# Altium project yfly.PrjPcb
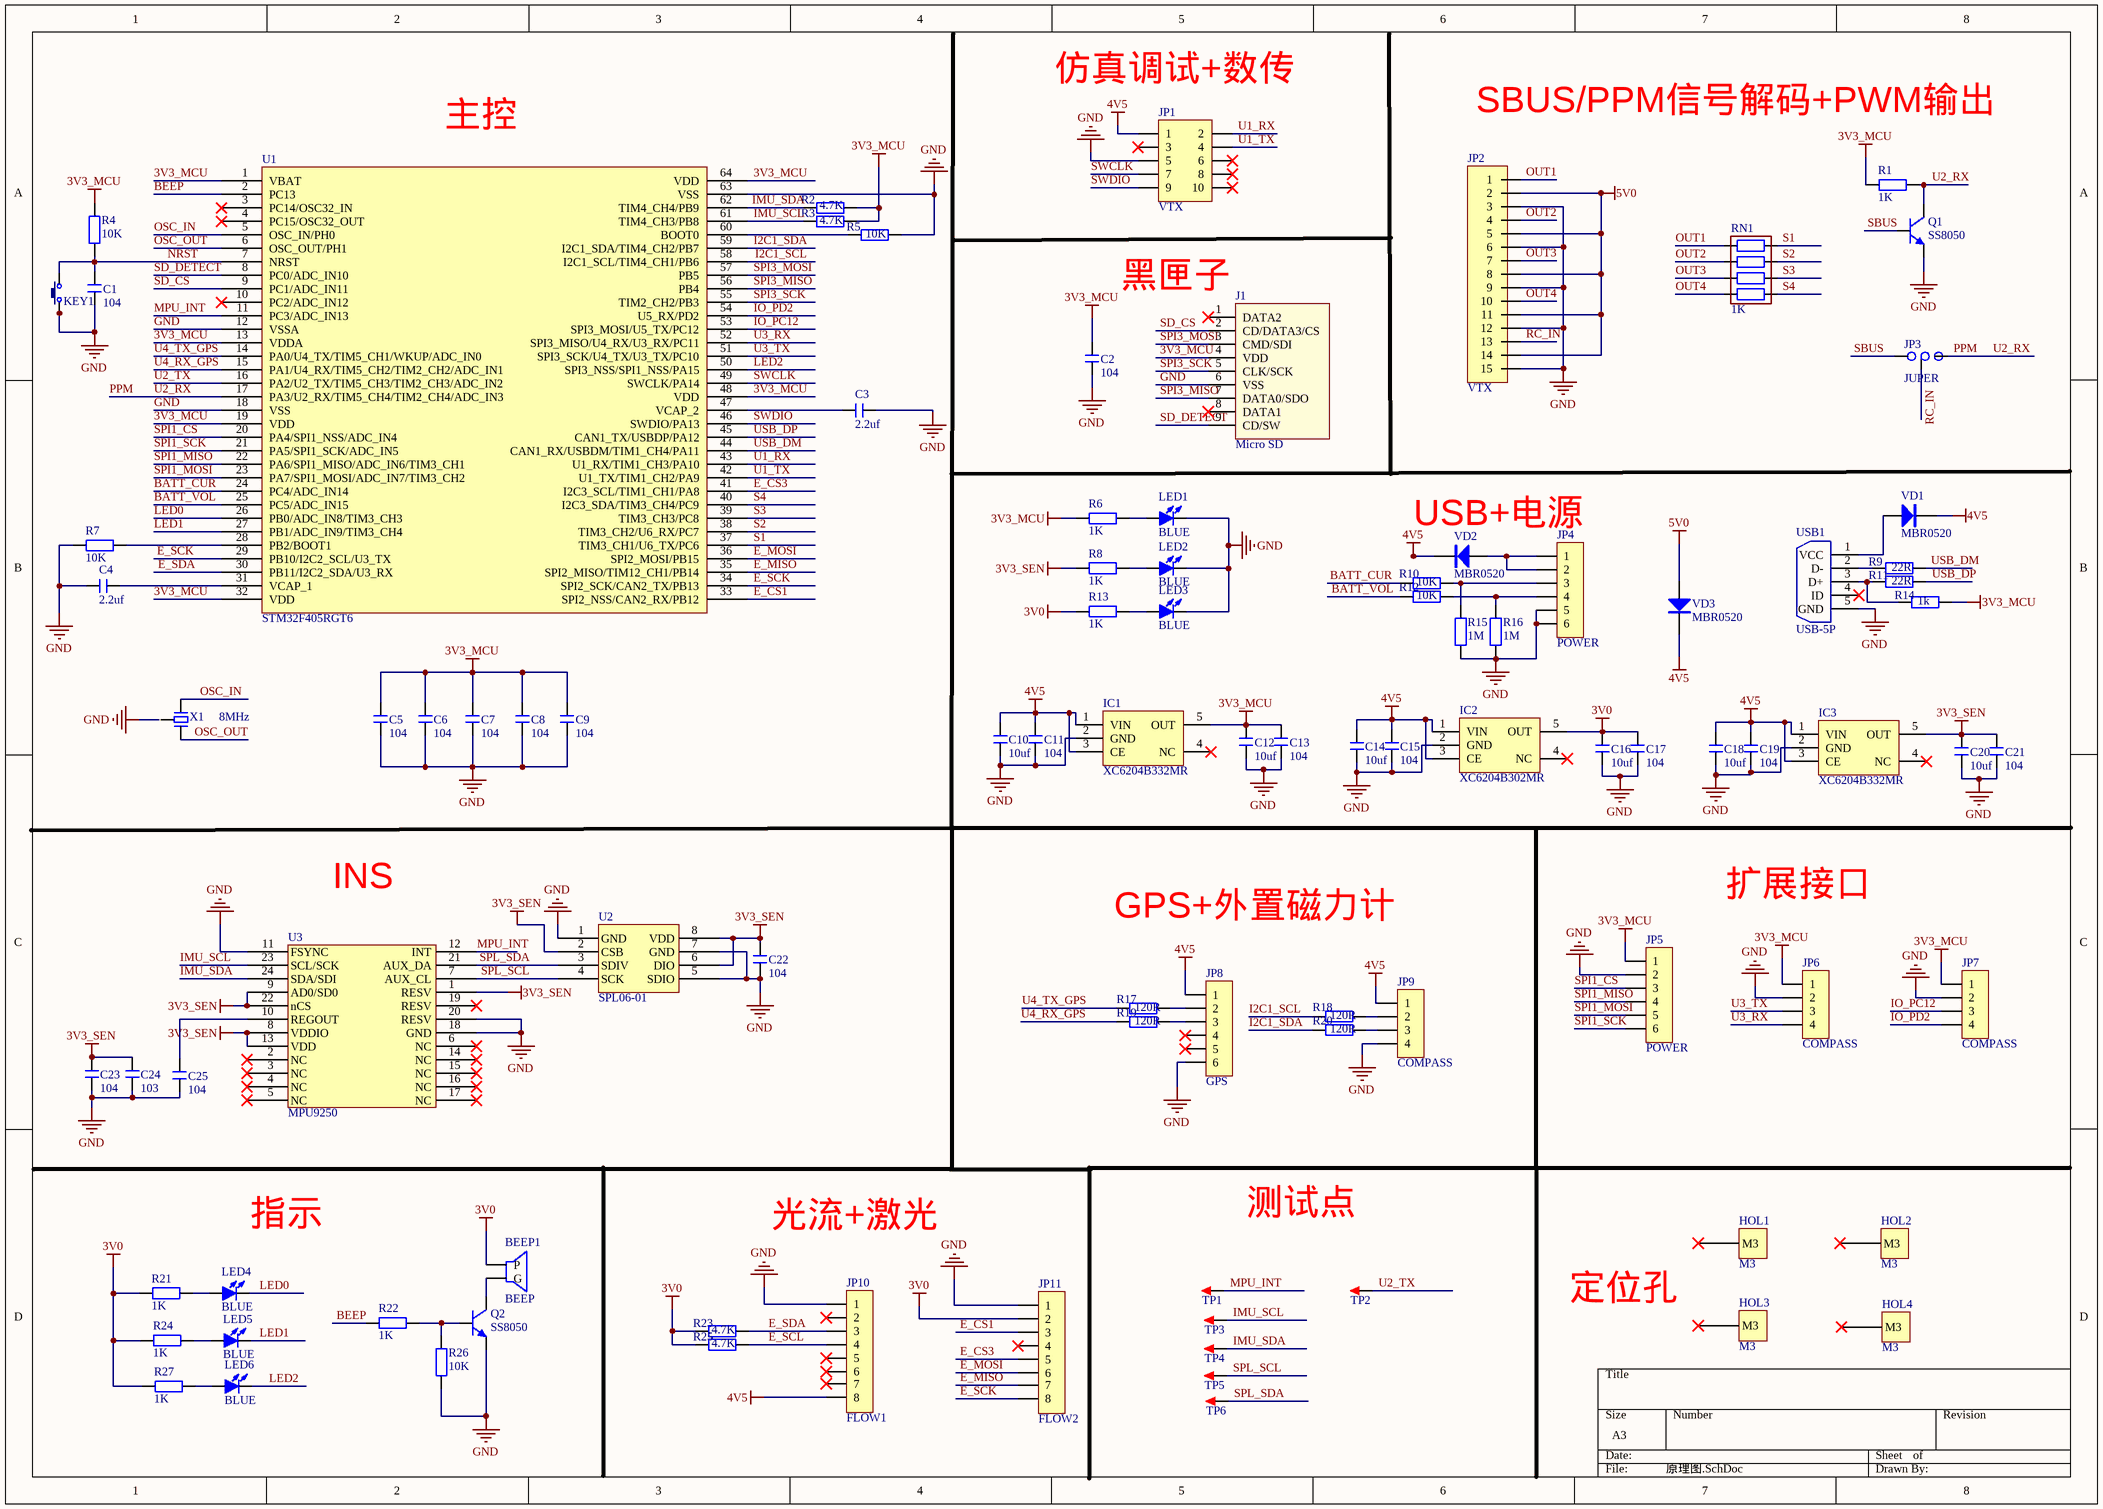
[diagram p0: 原理图.SchDoc]
1 sheet, 96 parts. Net scope: global (net labels, ports and power ports of the same name join across sheets).
Board file: PCB.PcbDoc

## Sheet 原理图.SchDoc
size A3

### Parts
BEEP1  BEEP  [BELL-5]
C1  104  [C 0603]
C2  104  [C 0603]
C3  2.2uf  [C 0603]
C4  2.2uf  [C 0603]
C5  104  [C 0603]
C6  104  [C 0603]
C7  104  [C 0603]
C8  104  [C 0603]
C9  104  [C 0603]
C10  10uf  [C 0603]
C11  104  [C 0603]
C12  10uf  [C 0603]
C13  104  [C 0603]
C14  10uf  [C 0603]
C15  104  [C 0603]
C16  10uf  [C 0603]
C17  104  [C 0603]
C18  10uf  [C 0603]
C19  104  [C 0603]
C20  10uf  [C 0603]
C21  104  [C 0603]
C22  104  [C 0603]
C23  104  [C 0603]
C24  103  [C 0603]
C25  104  [C 0603]
HOL1  M3  [M3]
HOL2  M3  [M3]
HOL3  M3  [M3]
HOL4  M3  [M3]
IC1  XC6204B332MR  [SOT23-5L]
IC2  XC6204B302MR  [SOT23-5L]
IC3  XC6204B332MR  [SOT23-5L]
J1  Micro SD  [Micro SD]
JP1  VTX  [2.54_2X5PIN]
JP2  VTX  [2.54_3X5PIN]
JP3  JUPER  [JUMPER 3P]
JP4  POWER  [HC1.25-6PIN]
JP5  POWER  [HC1.25-6PIN]
JP6  COMPASS  [HC1.25-4PIN]
JP7  COMPASS  [HC1.25-4PIN]
JP8  GPS  [HC1.25-6PIN]
JP9  COMPASS  [HC1.25-4PIN]
JP10  FLOW1  [PH2.0-8PIN]
JP11  FLOW2  [PH2.0-8PIN]
KEY1  KEY  [TSW 2*4*3.5-S-W]  (value not drawn)
LED1  BLUE  [LED 0603R]
LED2  BLUE  [LED 0603R]
LED3  BLUE  [LED 0603R]
LED4  BLUE  [LED 0603R]
LED5  BLUE  [LED 0603R]
LED6  BLUE  [LED 0603R]
Q1  SS8050  [SOT23-3L]
Q2  SS8050  [SOT23-3L]
R1  1K  [R 0603]
R2  4.7K  [R 0603]
R3  4.7K  [R 0603]
R4  10K  [R 0603]
R5  10K  [R 0603]
R6  1K  [R 0603]
R7  10K  [R 0603]
R8  1K  [R 0603]
R9  22R  [R 0603]
R10  10K  [R 0603]
R11  22R  [R 0603]
R12  10K  [R 0603]
R13  1K  [R 0603]
R14  1k  [R 0603]
R15  1M  [R 0603]
R16  1M  [R 0603]
R17  120R  [R 0603]
R18  120R  [R 0603]
R19  120R  [R 0603]
R20  120R  [R 0603]
R21  1K  [R 0603]
R22  1K  [R 0603]
R23  4.7K  [R 0603]
R24  1K  [R 0603]
R25  4.7K  [R 0603]
R26  10K  [R 0603]
R27  1K  [R 0603]
RN1  1K  [RES_P_8PIN]
TP1  TEST  [TEST PAD 1.8]  (value not drawn)
TP2  TEST  [TEST PAD 1.8]  (value not drawn)
TP3  TEST  [TEST PAD 1.8]  (value not drawn)
TP4  TEST  [TEST PAD 1.8]  (value not drawn)
TP5  TEST  [TEST PAD 1.8]  (value not drawn)
TP6  TEST  [TEST PAD 1.8]  (value not drawn)
U1  STM32F405RGT6  [LQFP64 10X10_L]
U2  SPL06-01  [LGA-8]
U3  MPU9250  [QFN24-0.4]
USB1  USB-5P  [USB-MICRO_E]
VD1  MBR0520  [SMA]
VD2  MBR0520  [SMA]
VD3  MBR0520  [SMA]
X1  8MHz  [XTAL-3215-3P]

### Nets
3V0: BEEP1.1(P) C16.2 C17.2 IC2.5(OUT) JP11.2 R13.1 R21.1 R23.2 R24.1 R25.2 R27.1
3V3_MCU: C2.1 C5.2 C6.2 C7.2 C8.2 C9.2 C12.2 C13.2 IC1.5(OUT) J1.4(VDD) JP5.1 JP6.1 JP7.1 R1.1 R2.1 R3.1 R4.2 R6.1 R14.2 U1.1(VBAT) U1.13(VDDA) U1.19(VDD) U1.32(VDD) U1.48(VDD) U1.64(VDD)
3V3_SEN: C20.2 C21.2 C22.2 C23.2 C24.2 IC3.5(OUT) R8.1 U2.2(CSB) U2.6(DIO) U2.8(VDD) U3.1(RESV) U3.8(VDDIO) U3.9(AD0/SD0) U3.13(VDD) U3.22(nCS)
4V5: C10.2 C11.2 C14.2 C15.2 C18.2 C19.2 IC1.1(VIN) IC1.3(CE) IC2.1(VIN) IC2.3(CE) IC3.1(VIN) IC3.3(CE) JP1.1 JP8.1 JP9.1 JP10.8 VD1.2(K) VD2.2(K) VD3.2(K)
5V0: JP2.2 JP2.5 JP2.8 JP2.11 JP2.14 VD3.1(A)
GND: C1.1 C2.2 C3.2 C4.1 C5.1 C6.1 C7.1 C8.1 C9.1 C10.1 C11.1 C12.1 C13.1 C14.1 C15.1 C16.1 C17.1 C18.1 C19.1 C20.1 C21.1 C22.1 C23.1 C24.1 C25.1 IC1.2(GND) IC2.2(GND) IC3.2(GND) J1.6(VSS) JP1.5 JP2.3 JP2.6 JP2.9 JP2.12 JP2.15 JP4.5 JP4.6 JP5.2 JP6.2 JP7.2 JP8.6 JP9.4 JP10.1 JP11.1 KEY1.1 LED1.2(K) LED2.2(K) LED3.2(K) Q1.2(E) Q2.2(E) R5.1 R7.1 R15.1 R16.1 R26.1 U1.12(VSSA) U1.18(VSS) U1.63(VSS) U2.1(GND) U2.5(SDIO) U2.7(GND) U3.11(FSYNC) U3.18(GND) U3.20(RESV) USB1.5(GND)
BATT_CUR: R10.1 U1.24(PC4/ADC_IN14)
BATT_VOL: R12.1 U1.25(PC5/ADC_IN15)
BEEP: R22.1 U1.2(PC13)
E_CS1: JP11.3 U1.33(SPI2_NSS/CAN2_RX/PB12)
E_CS3: JP11.5 U1.41(I2C3_SCL/TIM1_CH1/PA8)
E_MISO: JP11.7 U1.35(SPI2_MISO/TIM12_CH1/PB14)
E_MOSI: JP11.6 U1.36(SPI2_MOSI/PB15)
E_SCK: JP11.8 U1.29(PB10/I2C2_SCL/U3_TX) U1.34(SPI2_SCK/CAN2_TX/PB13)
E_SCL: JP10.4 R25.1
E_SDA: JP10.3 R23.1 U1.30(PB11/I2C2_SDA/U3_RX)
I2C1_SCL: R18.1 U1.58(I2C1_SCL/TIM4_CH1/PB6)
I2C1_SDA: R20.1 U1.59(I2C1_SDA/TIM4_CH2/PB7)
IMU_SCL: R3.2 TP3.1 U1.61(TIM4_CH3/PB8) U3.23(SCL/SCK)
IMU_SDA: R2.2 TP4.1 U1.62(TIM4_CH4/PB9) U3.24(SDA/SDI)
IO_PC12: JP7.3 U1.53(SPI3_MOSI/U5_TX/PC12)
IO_PD2: JP7.4 U1.54(U5_RX/PD2)
LED0: LED4.2(K) U1.26(PB0/ADC_IN8/TIM3_CH3)
LED1: LED5.2(K) U1.27(PB1/ADC_IN9/TIM3_CH4)
LED2: LED6.2(K) U1.50(SPI3_NSS/SPI1_NSS/PA15)
MPU_INT: TP1.1 U1.11(PC3/ADC_IN13) U3.12(INT)
NRST: C1.2 KEY1.2 R4.1 U1.7(NRST)
OSC_IN: U1.5(OSC_IN/PH0) X1.1
OSC_OUT: U1.6(OSC_OUT/PH1) X1.3
OUT1: JP2.1 RN1.1
OUT2: JP2.4 RN1.3
OUT3: JP2.7 RN1.5
OUT4: JP2.10 RN1.7
PPM: JP3.3 Q1.3(C) R1.2 U1.17(PA3/U2_RX/TIM5_CH4/TIM2_CH4/ADC_IN3)  [also labelled U2_RX]
RC_IN: JP2.13 JP3.2
S1: RN1.2 U1.37(TIM3_CH1/U6_TX/PC6)
S2: RN1.4 U1.38(TIM3_CH2/U6_RX/PC7)
S3: RN1.6 U1.39(TIM3_CH3/PC8)
S4: RN1.8 U1.40(I2C3_SDA/TIM3_CH4/PC9)
SBUS: JP3.1 Q1.1(B)
SD_CS: J1.2(CD/DATA3/CS) U1.9(PC1/ADC_IN11)
SD_DETECT: J1.9(CD/SW) U1.8(PC0/ADC_IN10)
SPI1_CS: JP5.3 U1.20(PA4/SPI1_NSS/ADC_IN4)
SPI1_MISO: JP5.4 U1.22(PA6/SPI1_MISO/ADC_IN6/TIM3_CH1)
SPI1_MOSI: JP5.5 U1.23(PA7/SPI1_MOSI/ADC_IN7/TIM3_CH2)
SPI1_SCK: JP5.6 U1.21(PA5/SPI1_SCK/ADC_IN5)
SPI3_MISO: J1.7(DATA0/SDO) U1.56(PB4)
SPI3_MOSI: J1.3(CMD/SDI) U1.57(PB5)
SPI3_SCK: J1.5(CLK/SCK) U1.55(TIM2_CH2/PB3)
SPL_SCL: TP5.1 U2.4(SCK) U3.7(AUX_CL)
SPL_SDA: TP6.1 U2.3(SDIV) U3.21(AUX_DA)
SWCLK: JP1.7 U1.49(SWCLK/PA14)
SWDIO: JP1.9 U1.46(SWDIO/PA13)
U1_RX: JP1.2 U1.43(U1_RX/TIM1_CH3/PA10)
U1_TX: JP1.4 U1.42(U1_TX/TIM1_CH2/PA9)
U2_TX: TP2.1 U1.16(PA2/U2_TX/TIM5_CH3/TIM2_CH3/ADC_IN2)
U3_RX: JP6.4 U1.52(SPI3_MISO/U4_RX/U3_RX/PC11)
U3_TX: JP6.3 U1.51(SPI3_SCK/U4_TX/U3_TX/PC10)
U4_RX_GPS: R19.1 U1.15(PA1/U4_RX/TIM5_CH2/TIM2_CH2/ADC_IN1)
U4_TX_GPS: R17.1 U1.14(PA0/U4_TX/TIM5_CH1/WKUP/ADC_IN0)
USB_DM: R9.2 U1.44(CAN1_RX/USBDM/TIM1_CH4/PA11)
USB_DP: R11.2 U1.45(CAN1_TX/USBDP/PA12)
NetBEEP1_2: BEEP1.2(G) Q2.3(C)
NetC3_1: C3.1 U1.47(VCAP_2)
NetC4_2: C4.2 U1.31(VCAP_1)
NetC25_2: C25.2 U3.10(REGOUT)
NetJP4_1: JP4.1 JP4.2 VD2.1(A)
NetJP4_3: JP4.3 R10.2 R15.2
NetJP4_4: JP4.4 R12.2 R16.2
NetJP8_2: JP8.2 R17.2
NetJP8_3: JP8.3 R19.2
NetJP9_2: JP9.2 R18.2
NetJP9_3: JP9.3 R20.2
NetLED1_1: LED1.1(A) R6.2
NetLED2_1: LED2.1(A) R8.2
NetLED3_1: LED3.1(A) R13.2
NetLED4_1: LED4.1(A) R21.2
NetLED5_1: LED5.1(A) R24.2
NetLED6_1: LED6.1(A) R27.2
NetQ2_1: Q2.1(B) R22.2 R26.2
NetR5_2: R5.2 U1.60(BOOT0)
NetR7_2: R7.2 U1.28(PB2/BOOT1)
NetR9_1: R9.1 USB1.2(D-)
NetR11_1: R11.1 R14.1 USB1.3(D+)
NetUSB1_1: USB1.1(VCC) VD1.1(A)

Not connected (* = marked no-connect by the designer): HOL1 1(M3)*; HOL2 1(M3)*; HOL3 1(M3)*; HOL4 1(M3)*; IC1 4(NC)*; IC2 4(NC)*; IC3 4(NC)*; J1 1(DATA2)* 8(DATA1)*; JP1 3* 6* 8* 10*; JP8 4* 5*; JP10 2* 5* 6* 7*; JP11 4*; U1 3(PC14/OSC32_IN)* 4(PC15/OSC32_OUT)* 10(PC2/ADC_IN12)*; U3 2(NC)* 3(NC)* 4(NC)* 5(NC)* 6(NC)* 14(NC)* 15(NC)* 16(NC)* 17(NC)* 19(RESV)*; USB1 4(ID)*; X1 2

### Notes on the sheet
- (near JP1) 仿真调试+数传
- (near U1) 主控
- SBUS/PPM信号解码+PWM输出
- 黑匣子
- (near VD2) USB+电源
- INS
- GPS+外置磁力计
- 扩展接口
- 指示
- 光流+激光
- 测试点
- 定位孔

### Library data of the parts
C1-C25 = C: 无极性贴片电容; 版权归属: 源创客; BOM名称: 无极性贴片电容; 学习资源: www.ooocke.com
HOL1-HOL4 = M3: 定位孔
IC1-IC3 = LDO XC6204: LDO; BOM名称: 稳压芯片; 版权归属: 源创客; 学习资源: www.ooocke.com
J1 = Micro SD: Micro SD卡; 版权归属: 源创客; BOM名称: Micro SD卡; 学习资源: www.ooocke.com
JP1 = Header 5X2: 5*2P接插件; 版权归属: 源创客; BOM名称: 5*2P接插件; 学习资源: www.ooocke.com
JP2 = Header 5X3: 5*3P接插件; BOM名称: 5*2P接插件; 版权归属: 源创客; 学习资源: www.ooocke.com
JP3 = JUMPER 3P: 三点焊盘跳线
JP4 JP5 JP8 = Header 6: 6P接插件; 版权归属: 源创客; BOM名称: 6P接插件; 学习资源: www.ooocke.com
JP6 JP7 JP9 = Header 4: 4P接插件; 版权归属: 源创客; BOM名称: 4P接插件; 学习资源: www.ooocke.com
JP10 JP11 = Header 8: 8P接插件; BOM名称: 6P接插件; 版权归属: 源创客; 学习资源: www.ooocke.com
KEY1 = KEY: 按键; BOM名称: 3x6轻触开关; 版权归属: 源创客; 学习资源: www.ooocke.com
LED1-LED6 = LED-SMD: 贴片LED; 版权归属: 源创客; BOM名称: 贴片LED; 学习资源: www.ooocke.com
Q1 Q2 = 8050-SMD: 高频放大-NPN型; 版权归属: 源创客; 属性: 40V 1.5A 1W 100MHZ; BOM名称: 高频放大-NPN型; 学习资源: www.ooocke.com
R1-R27 = R: 贴片电阻; 版权归属: 源创客; BOM名称: 贴片电阻; 学习资源: www.ooocke.com
RN1 = R_8PIN: 贴片排阻; BOM名称: 贴片电阻; 版权归属: 源创客; 学习资源: www.ooocke.com
TP1-TP6 = TEST: 测试点; 版权归属: 源创客; BOM名称: 测试点; 学习资源: www.ooocke.com
U1 = STM32F405RGT6: Flaah:256/RAM:48/IO:51
U2 = BMP280
USB1 = USB-5P: 微型USB母座; 版权归属: 源创客; BOM名称: 微型USB母座; 学习资源: www.ooocke.com
VD1-VD3 = SS14: 肖特基二极管; 版权归属: 源创客; 属性: 40V/1A; BOM名称: 肖特基二极管; 学习资源: www.ooocke.com
X1 = XTAL-3P: 3脚无源晶振; BOM名称: 2脚晶振; 版权归属: 源创客; 学习资源: www.ooocke.com